# Altium schematic sheet 48V_Converter2.SchDoc
size A; SheetNumber: 9; SheetTotal: 9
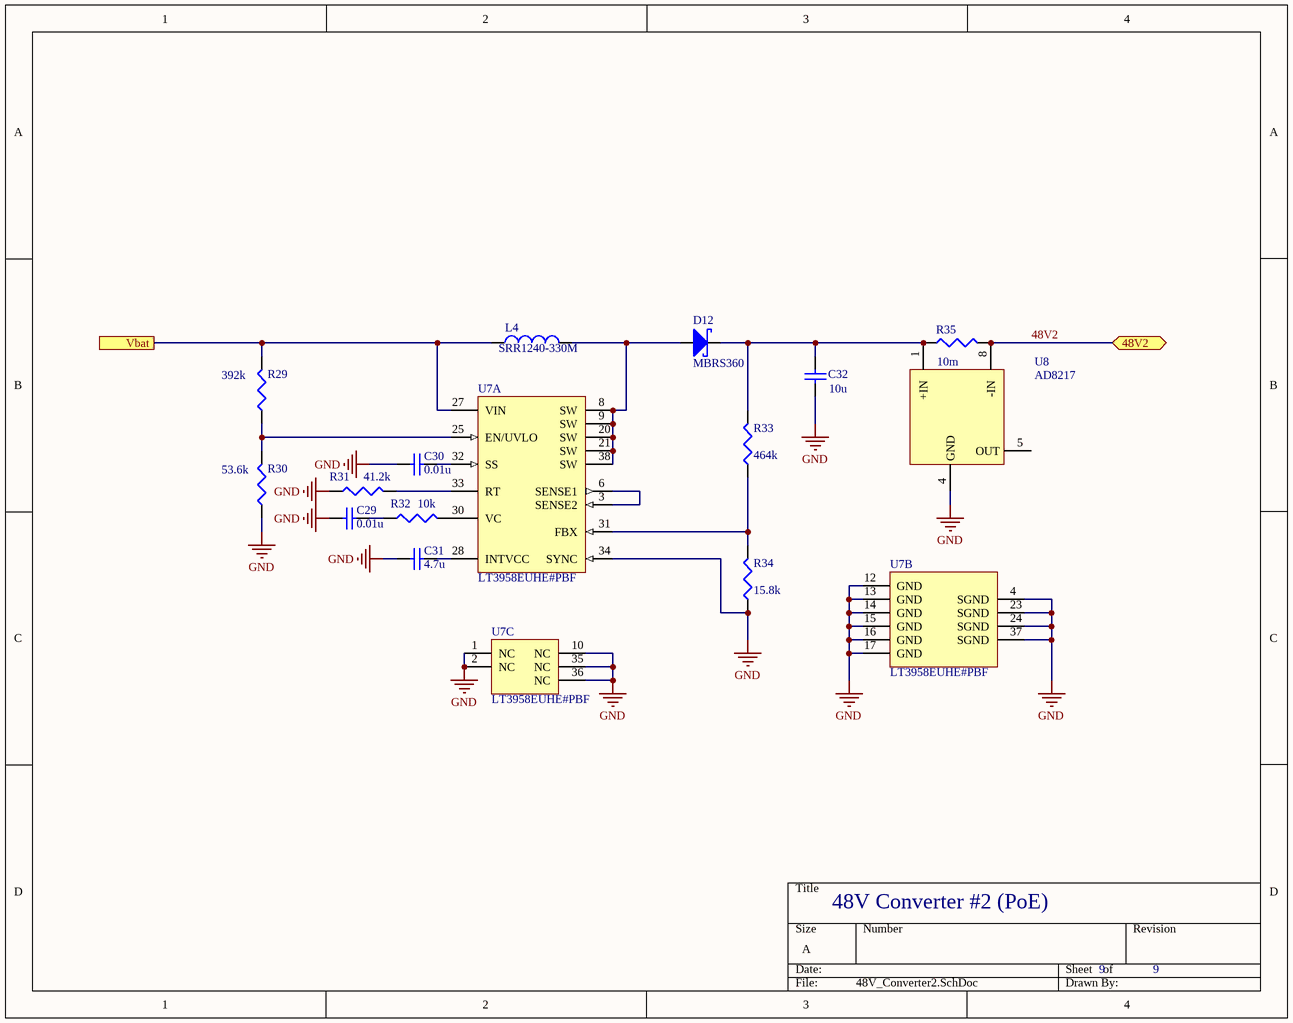
[diagram p0: 48V_Converter2.SchDoc]

## Parts
C29  value 0.01u  [C1206]  (hidden comment: Cap Semi)
C30  value 0.01u  [C1206]  (hidden comment: Cap Semi)
C31  value 4.7u  [C1206]  (hidden comment: Cap Semi)
C32  value 10u  [C1206]  (hidden comment: Cap Semi)
D12  MBRS360  [MBRS360]
L4  SRR1240-330M  [SRR1240]
R29  value 392k  [J1-0603]  (hidden comment: Res3)
R30  value 53.6k  [J1-0603]  (hidden comment: Res3)
R31  value 41.2k  [J1-0603]  (hidden comment: Res3)
R32  value 10k  [J1-0603]  (hidden comment: Res3)
R33  value 464k  [J1-0603]  (hidden comment: Res3)
R34  value 15.8k  [J1-0603]  (hidden comment: Res3)
R35  value 10m  [J1-0603]  (hidden comment: Res3)
U7  LT3958EUHE#PBF  [LT-UHE-36-V-UHE28MA_V]  (parts A,B,C of 3)
U8  AD8217  [AD8217]

## Ports
48V2 (bidir), Vbat

## Nets
GND: C29.1 C30.1 C31.1 C32.1 R30.1 R31.1 R34.1 U7.1(NC) U7.2(NC) U7.4(SGND) U7.10(NC) U7.12(GND) U7.13(GND) U7.14(GND) U7.15(GND) U7.16(GND) U7.17(GND) U7.23(SGND) U7.24(SGND) U7.34(SYNC) U7.35(NC) U7.36(NC) U7.37(SGND) U8.4(GND)
48V2: R35.2 U8.8(-IN) ; port 48V2
Vbat: L4.1 R29.2 U7.27(VIN) ; port Vbat
NetC29_2: C29.2 R32.1
NetC30_2: C30.2 U7.32(SS)
NetC31_2: C31.2 U7.28(INTVCC)
NetC32_2: C32.2 D12.2(Cathode) R33.2 R35.1 U8.1(+IN)
NetD12_1: D12.1(Anode) L4.2 U7.8(SW) U7.9(SW) U7.20(SW) U7.21(SW) U7.38(SW)
NetR29_1: R29.1 R30.2 U7.25(EN/UVLO)
NetR31_2: R31.2 U7.33(RT)
NetR32_2: R32.2 U7.30(VC)
NetR33_1: R33.1 R34.2 U7.31(FBX)
NetU7_3: U7.3(SENSE2) U7.6(SENSE1)

Not connected (* = marked no-connect by the designer): U8 5(OUT)

## Notes on the sheet
- 48V Converter #2 (PoE)

## Library data of the parts
C29-C32 = Cap Semi: Capacitor (Semiconductor SIM Model); Published: 8-Jun-2000; LatestRevisionDate: 29-May-2009; LatestRevisionNote: IPC-7351 Footprint Added.; PackageReference: C1206; Publisher: Altium Limited; PackageDescription: Chip Capacitor
D12 = MBRS360: DIODE SCHOTTKY 60V 3A SMC; Digikey: https://www.digikey.com/product-detail/en/on-semiconductor/MBRS360T3G/MBRS360T3GOSCT-ND/918010; Datasheet: https://www.onsemi.com/pub/Collateral/MBRS360T3-D.PDF
L4 = SRR1240: FIXED IND 33UH 2.3A 97 MOHM SMD; Digikey: https://www.digikey.com/product-detail/en/bourns-inc/SRR1240-330M/SRR1240-330MCT-ND/2127395; Datasheet: https://www.bourns.com/docs/Product-Datasheets/SRR1240.pdf
R29-R35 = Res3: Resistor; Published: 8-Jun-2000; LatestRevisionDate: 29-May-2009; LatestRevisionNote: IPC-7351 Footprint Added.; PackageReference: J1-0603; Publisher: Altium Limited; PackageDescription: Chip Resistor
U7 = LT3958EUHE#PBF: High Input Voltage, Boost, Flyback, SEPIC and Inverting Converter, 36-pin QFN (UHE-36-UHE28MA), -40 to 125 degC, Pb-Free; Manufacturer: Linear Technology; Frequency Adjust Range: 100kHz - 1MHz; Number of Outputs: 1; PackageVersion: Rev. D, 02/2012; PackageReference: UHE-36; PackageDescription: 28-Pin Plastic QFN, Body 5 x 6 mm, Pitch 0.5 mm; Supplier 1: Digi-Key; Supplier Part Number 1: LT3958EUHE#PBF-ND; Supplier 2: Farnell; Supplier Part Number 2: 2294964; Supplier 3: Newark; Supplier Part Number 3: 78R8466; RoHS: TRUE; Mounting Technology: Surface Mount; PartNumber: LT3958EUHE#PBF; ComponentLink1Description: Manufacturer URL; ComponentLink1URL: http://www.linear.com/; ComponentLink2Description: Datasheet; ComponentLink2URL: http://cds.linear.com/docs/en/datasheet/3958f.pdf; ComponentLink3Description: Package Specification; ComponentLink3URL: http://cds.linear.com/docs/en/packaging/QFN_28_05-08-1836.pdf
U8 = AD8217: High Resolution, Zero-Drift  Current Shunt Monitor; Datasheet: https://www.analog.com/media/en/technical-documentation/data-sheets/AD8217.pdf